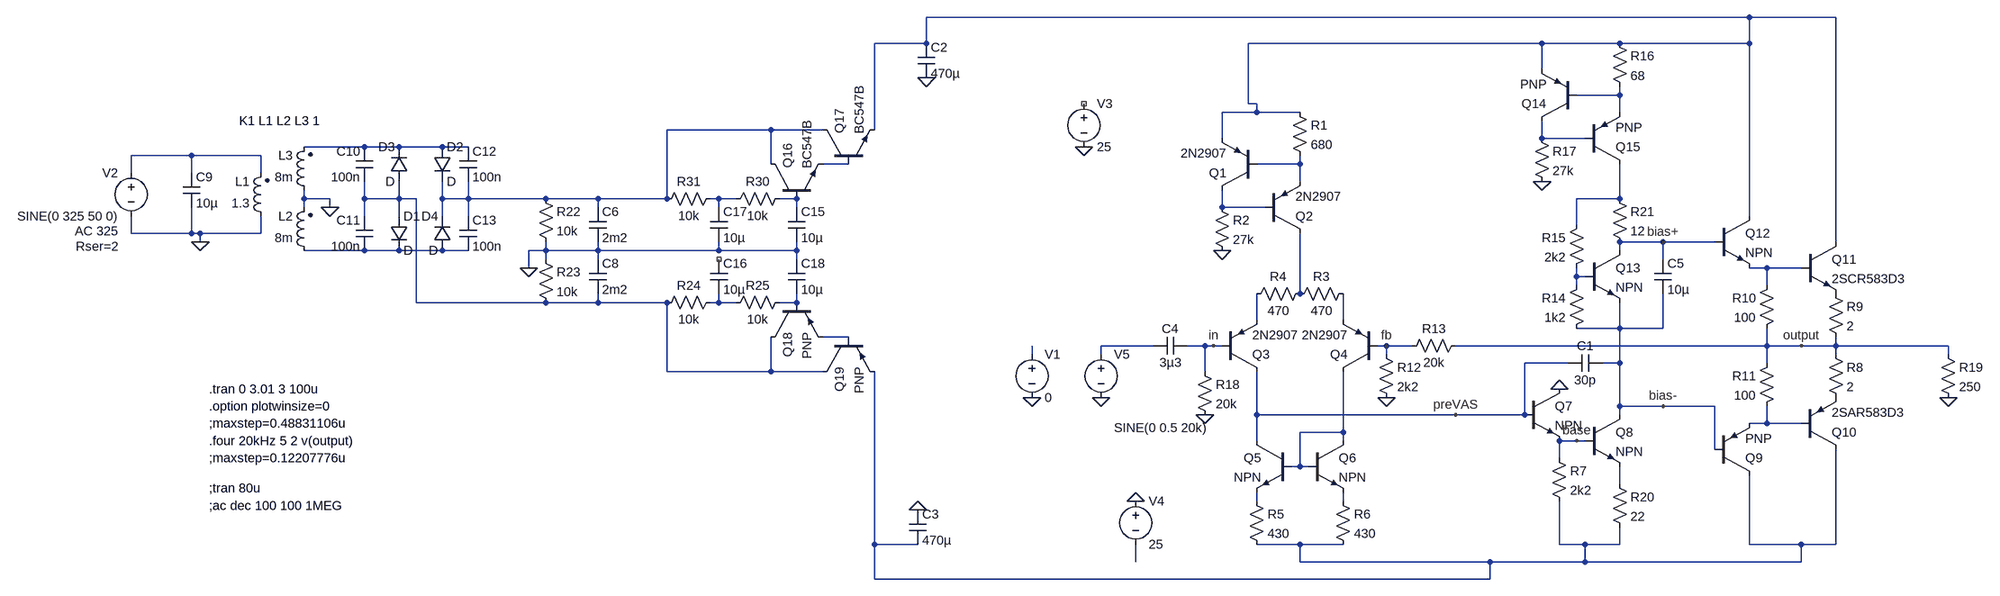
[diagram p0: schematic full_amplifier.asc]
full_amplifier.asc, the LTspice schematic file:
Version 4
SHEET 1 4476 896
WIRE 1008 -176 -592 -176
WIRE 1168 -176 1008 -176
WIRE -592 -128 -592 -176
WIRE -592 -128 -688 -128
WIRE 624 -128 80 -128
WIRE 768 -128 624 -128
WIRE 1008 -128 1008 -176
WIRE 1008 -128 768 -128
WIRE 624 -80 624 -128
WIRE 768 -32 768 -48
WIRE 768 -32 688 -32
WIRE 80 -16 80 -128
WIRE 96 -16 80 -16
WIRE 96 0 96 -16
WIRE 96 0 32 0
WIRE 176 0 96 0
WIRE 768 0 768 -32
WIRE -880 32 -1072 32
WIRE -784 32 -880 32
WIRE -688 32 -688 -128
WIRE 32 48 32 0
WIRE 624 48 624 16
WIRE 704 48 624 48
WIRE -1632 64 -1744 64
WIRE -1568 64 -1632 64
WIRE -1488 64 -1568 64
WIRE -1440 64 -1488 64
WIRE -1952 80 -2064 80
WIRE -1824 80 -1952 80
WIRE -880 96 -880 32
WIRE -736 96 -784 96
WIRE 176 96 176 80
WIRE 176 96 96 96
WIRE -2064 112 -2064 80
WIRE -1952 112 -1952 80
WIRE -1824 112 -1824 80
WIRE 176 128 176 96
WIRE -1744 160 -1744 144
WIRE -1696 160 -1744 160
WIRE -1632 160 -1632 128
WIRE -1568 160 -1568 128
WIRE -1568 160 -1632 160
WIRE -1536 160 -1568 160
WIRE -1488 160 -1488 128
WIRE -1440 160 -1440 128
WIRE -1440 160 -1488 160
WIRE -1296 160 -1440 160
WIRE -1200 160 -1296 160
WIRE -1072 160 -1072 32
WIRE -1072 160 -1200 160
WIRE -976 160 -992 160
WIRE -944 160 -976 160
WIRE -832 160 -864 160
WIRE 768 160 768 96
WIRE 768 160 688 160
WIRE -1744 176 -1744 160
WIRE -1696 176 -1696 160
WIRE -1200 176 -1200 160
WIRE -976 176 -976 160
WIRE -832 176 -832 160
WIRE 32 176 32 144
WIRE 112 176 32 176
WIRE -1632 192 -1632 160
WIRE -1568 192 -1568 160
WIRE -1488 192 -1488 160
WIRE -1440 192 -1440 160
WIRE 1008 192 1008 -128
WIRE 688 208 688 160
WIRE -2064 224 -2064 192
WIRE -1952 224 -1952 176
WIRE -1952 224 -2064 224
WIRE -1936 224 -1952 224
WIRE -1824 224 -1824 192
WIRE -1824 224 -1936 224
WIRE -1936 240 -1936 224
WIRE 848 240 768 240
WIRE 944 240 848 240
WIRE 1168 240 1168 -176
WIRE -1632 256 -1744 256
WIRE -1568 256 -1632 256
WIRE -1488 256 -1568 256
WIRE -1440 256 -1488 256
WIRE -1296 256 -1296 240
WIRE -1296 256 -1328 256
WIRE -1200 256 -1200 240
WIRE -1200 256 -1296 256
WIRE -976 256 -976 240
WIRE -976 256 -1200 256
WIRE -832 256 -832 240
WIRE -832 256 -976 256
WIRE 768 256 768 240
WIRE -1296 272 -1296 256
WIRE -1200 272 -1200 256
WIRE -832 272 -832 256
WIRE 848 272 848 240
WIRE -1328 288 -1328 256
WIRE 1040 288 1008 288
WIRE 1104 288 1040 288
WIRE 688 304 688 288
WIRE 704 304 688 304
WIRE 688 320 688 304
WIRE 1040 320 1040 288
WIRE 176 336 176 224
WIRE -1536 352 -1536 160
WIRE -1296 352 -1536 352
WIRE -1200 352 -1200 336
WIRE -1200 352 -1296 352
WIRE -1072 352 -1200 352
WIRE -976 352 -976 336
WIRE -976 352 -992 352
WIRE -944 352 -976 352
WIRE -832 352 -832 336
WIRE -832 352 -864 352
WIRE 96 384 96 336
WIRE 256 384 256 336
WIRE 768 400 768 352
WIRE 768 400 688 400
WIRE 848 400 848 336
WIRE 848 400 768 400
WIRE -736 416 -784 416
WIRE -96 432 -192 432
WIRE 0 432 -32 432
WIRE 16 432 0 432
WIRE 32 432 16 432
WIRE 336 432 320 432
WIRE 384 432 336 432
WIRE 1040 432 1040 400
WIRE 1040 432 464 432
WIRE 1104 432 1040 432
WIRE 1168 432 1168 416
WIRE 1168 432 1104 432
WIRE 1376 432 1168 432
WIRE -320 448 -320 432
WIRE -192 448 -192 432
WIRE 336 448 336 432
WIRE 1168 448 1168 432
WIRE 1376 448 1376 432
WIRE 672 464 592 464
WIRE 768 464 768 400
WIRE 768 464 736 464
WIRE 1040 464 1040 432
WIRE -1072 480 -1072 352
WIRE -880 480 -880 416
WIRE -880 480 -1072 480
WIRE -784 480 -880 480
WIRE 0 480 0 432
WIRE 768 544 768 464
WIRE 848 544 768 544
WIRE 944 544 848 544
WIRE 96 560 96 480
WIRE 464 560 96 560
WIRE 592 560 592 464
WIRE 592 560 464 560
WIRE 768 560 768 544
WIRE 1040 576 1040 544
WIRE 1040 576 1008 576
WIRE 1104 576 1040 576
WIRE 256 592 256 480
WIRE 256 592 176 592
WIRE 96 608 96 560
WIRE 256 608 256 592
WIRE 688 608 656 608
WIRE 704 608 688 608
WIRE 944 624 944 544
WIRE 656 640 656 608
WIRE 176 656 176 592
WIRE 176 656 160 656
WIRE 192 656 176 656
WIRE 768 688 768 656
WIRE 96 720 96 704
WIRE 256 720 256 704
WIRE -688 800 -688 480
WIRE -608 800 -688 800
WIRE 176 800 96 800
WIRE 256 800 176 800
WIRE 656 800 656 720
WIRE 704 800 656 800
WIRE 768 800 768 768
WIRE 768 800 704 800
WIRE 1008 800 1008 672
WIRE 1104 800 1008 800
WIRE 1168 800 1168 624
WIRE 1168 800 1104 800
WIRE -128 832 -128 800
WIRE 176 832 176 800
WIRE 528 832 176 832
WIRE 704 832 704 800
WIRE 704 832 528 832
WIRE 1104 832 1104 800
WIRE 1104 832 704 832
WIRE -688 864 -688 800
WIRE 528 864 528 832
WIRE 528 864 -688 864
FLAG 32 256 0
FLAG 656 512 0
FLAG 336 528 0
FLAG 624 128 0
FLAG 0 560 0
FLAG 1104 432 output
FLAG 848 240 bias+
FLAG 848 544 bias-
FLAG 464 560 preVAS
FLAG 336 432 fb
FLAG 1376 528 0
FLAG 688 608 base
FLAG 16 432 in
FLAG -192 528 0
FLAG -320 528 0
FLAG -1936 240 0
FLAG -1328 288 0
FLAG -1696 176 0
FLAG -592 -64 0
FLAG -224 64 0
FLAG -128 720 0
FLAG -608 736 0
SYMBOL pnp 96 144 R180
SYMATTR InstName Q1
SYMATTR Value 2N2907
SYMBOL pnp 112 224 M180
SYMATTR InstName Q2
SYMATTR Value 2N2907
SYMBOL res 160 -16 R0
SYMATTR InstName R1
SYMATTR Value 680
SYMBOL res 16 160 R0
SYMATTR InstName R2
SYMATTR Value 27k
SYMBOL res 272 320 R90
WINDOW 0 0 56 VBottom 2
WINDOW 3 32 56 VTop 2
SYMATTR InstName R3
SYMATTR Value 470
SYMBOL res 192 320 R90
WINDOW 0 0 56 VBottom 2
WINDOW 3 32 56 VTop 2
SYMATTR InstName R4
SYMATTR Value 470
SYMBOL pnp 32 480 M180
SYMATTR InstName Q3
SYMATTR Value 2N2907
SYMBOL pnp 320 480 R180
SYMATTR InstName Q4
SYMATTR Value 2N2907
SYMBOL npn 160 608 M0
SYMATTR InstName Q5
SYMBOL npn 192 608 R0
SYMATTR InstName Q6
SYMBOL res 80 704 R0
SYMATTR InstName R5
SYMATTR Value 430
SYMBOL res 240 704 R0
SYMATTR InstName R6
SYMATTR Value 430
SYMBOL npn 592 512 R0
SYMATTR InstName Q7
SYMBOL npn 704 560 R0
SYMATTR InstName Q8
SYMBOL res 640 624 R0
SYMATTR InstName R7
SYMATTR Value 2k2
SYMBOL cap 736 448 R90
WINDOW 0 0 32 VBottom 2
WINDOW 3 32 32 VTop 2
SYMATTR InstName C1
SYMATTR Value 30p
SYMBOL pnp 944 672 M180
SYMATTR InstName Q9
SYMBOL pnp 1104 624 M180
SYMATTR InstName Q10
SYMATTR Value 2SAR583D3
SYMBOL res 1152 432 R0
SYMATTR InstName R8
SYMATTR Value 2
SYMBOL res 1152 320 R0
SYMATTR InstName R9
SYMATTR Value 2
SYMBOL npn 1104 240 R0
SYMATTR InstName Q11
SYMATTR Value 2SCR583D3
SYMBOL npn 944 192 R0
SYMATTR InstName Q12
SYMBOL res 1056 304 M0
SYMATTR InstName R10
SYMATTR Value 100
SYMBOL res 1056 448 M0
SYMATTR InstName R11
SYMATTR Value 100
SYMBOL res 320 432 R0
SYMATTR InstName R12
SYMATTR Value 2k2
SYMBOL res 480 416 R90
WINDOW 0 0 56 VBottom 2
WINDOW 3 32 56 VTop 2
SYMATTR InstName R13
SYMATTR Value 20k
SYMBOL npn 704 256 R0
SYMATTR InstName Q13
SYMBOL res 704 304 M0
SYMATTR InstName R14
SYMATTR Value 1k2
SYMBOL res 704 192 M0
SYMATTR InstName R15
SYMATTR Value 2k2
SYMBOL pnp 688 16 R180
SYMATTR InstName Q14
SYMBOL pnp 704 96 M180
SYMATTR InstName Q15
SYMBOL res 752 -144 R0
SYMATTR InstName R16
SYMATTR Value 68
SYMBOL res 608 32 R0
SYMATTR InstName R17
SYMATTR Value 27k
SYMBOL res -16 464 R0
SYMATTR InstName R18
SYMATTR Value 20k
SYMBOL res 1360 432 R0
SYMATTR InstName R19
SYMATTR Value 250
SYMBOL res 752 672 R0
SYMATTR InstName R20
SYMATTR Value 22
SYMBOL voltage -192 432 R0
WINDOW 3 24 152 Left 2
WINDOW 123 24 124 Left 2
WINDOW 39 0 0 Left 0
SYMATTR Value SINE(0 0.5 20k)
SYMATTR InstName V5
SYMBOL cap -32 416 R90
WINDOW 0 0 32 VBottom 2
WINDOW 3 32 32 VTop 2
SYMATTR InstName C4
SYMATTR Value 3µ3
SYMBOL res 752 144 R0
SYMATTR InstName R21
SYMATTR Value 12
SYMBOL cap 832 272 R0
SYMATTR InstName C5
SYMATTR Value 10µ
SYMBOL voltage -320 432 R0
WINDOW 123 0 0 Left 0
WINDOW 39 0 0 Left 0
SYMATTR InstName V1
SYMATTR Value 0
SYMBOL ind2 -1808 208 R180
WINDOW 0 36 80 Left 2
WINDOW 3 36 40 Left 2
SYMATTR InstName L1
SYMATTR Value 1.3
SYMATTR Type ind
SYMATTR SpiceLine Rser=100
SYMBOL ind2 -1728 272 R180
WINDOW 0 36 80 Left 2
WINDOW 3 36 40 Left 2
SYMATTR InstName L2
SYMATTR Value 8m
SYMATTR Type ind
SYMATTR SpiceLine Rser=0.6
SYMBOL voltage -2064 96 M0
WINDOW 123 24 124 Left 2
WINDOW 39 24 152 Left 2
SYMATTR Value2 AC 325
SYMATTR SpiceLine Rser=2
SYMATTR InstName V2
SYMATTR Value SINE(0 325 50 0)
SYMBOL ind2 -1728 160 R180
WINDOW 0 36 80 Left 2
WINDOW 3 36 40 Left 2
SYMATTR InstName L3
SYMATTR Value 8m
SYMATTR Type ind
SYMATTR SpiceLine Rser=0.6
SYMBOL res -1312 144 R0
SYMATTR InstName R22
SYMATTR Value 10k
SYMBOL res -1312 256 R0
SYMATTR InstName R23
SYMATTR Value 10k
SYMBOL diode -1584 192 R0
SYMATTR InstName D1
SYMBOL diode -1504 64 R0
SYMATTR InstName D2
SYMBOL diode -1552 128 R180
WINDOW 0 24 64 Left 2
WINDOW 3 24 0 Left 2
SYMATTR InstName D3
SYMBOL diode -1472 256 R180
WINDOW 0 24 64 Left 2
WINDOW 3 24 0 Left 2
SYMATTR InstName D4
SYMBOL cap -1216 176 R0
SYMATTR InstName C6
SYMATTR Value 2m2
SYMATTR SpiceLine Rser=100m Lser=20n
SYMBOL cap -1968 112 R0
SYMATTR InstName C9
SYMATTR Value 10µ
SYMBOL cap -1616 64 M0
SYMATTR InstName C10
SYMATTR Value 100n
SYMBOL cap -1616 192 M0
SYMATTR InstName C11
SYMATTR Value 100n
SYMBOL cap -1456 64 R0
SYMATTR InstName C12
SYMATTR Value 100n
SYMBOL cap -1456 192 R0
SYMATTR InstName C13
SYMATTR Value 100n
SYMBOL res -848 144 R90
WINDOW 0 0 56 VBottom 2
WINDOW 3 32 56 VTop 2
SYMATTR InstName R30
SYMATTR Value 10k
SYMBOL cap -848 176 R0
SYMATTR InstName C15
SYMATTR Value 10µ
SYMBOL npn -880 160 R270
SYMATTR InstName Q16
SYMATTR Value BC547B
SYMBOL res -976 144 R90
WINDOW 0 0 56 VBottom 2
WINDOW 3 32 56 VTop 2
SYMATTR InstName R31
SYMATTR Value 10k
SYMBOL cap -992 176 R0
SYMATTR InstName C17
SYMATTR Value 10µ
SYMBOL npn -784 96 R270
SYMATTR InstName Q17
SYMATTR Value BC547B
SYMBOL cap -1216 272 R0
SYMATTR InstName C8
SYMATTR Value 2m2
SYMATTR SpiceLine Rser=100m Lser=20n
SYMBOL cap -992 272 R0
SYMATTR InstName C16
SYMATTR Value 10µ
SYMBOL cap -848 272 R0
SYMATTR InstName C18
SYMATTR Value 10µ
SYMBOL res -976 336 R90
WINDOW 0 0 56 VBottom 2
WINDOW 3 32 56 VTop 2
SYMATTR InstName R24
SYMATTR Value 10k
SYMBOL res -848 336 R90
WINDOW 0 0 56 VBottom 2
WINDOW 3 32 56 VTop 2
SYMATTR InstName R25
SYMATTR Value 10k
SYMBOL pnp -880 352 M90
SYMATTR InstName Q18
SYMBOL pnp -784 416 M90
SYMATTR InstName Q19
SYMBOL cap -608 -128 R0
SYMATTR InstName C2
SYMATTR Value 470µ
SYMATTR SpiceLine Rser=100m Lser=20n
SYMBOL cap -624 736 R0
SYMATTR InstName C3
SYMATTR Value 470µ
SYMATTR SpiceLine Rser=100m Lser=20n
SYMBOL voltage -224 -32 R0
WINDOW 123 0 0 Left 0
WINDOW 39 0 0 Left 0
SYMATTR InstName V3
SYMATTR Value 25
SYMBOL voltage -128 704 R0
WINDOW 123 0 0 Left 0
WINDOW 39 0 0 Left 0
SYMATTR InstName V4
SYMATTR Value 25
TEXT -1920 728 Left 2 !;ac dec 100 100 1MEG
TEXT -1920 696 Left 2 !;tran 80u
TEXT -1920 512 Left 2 !.tran 0 3.01 3 100u
TEXT -1920 544 Left 2 !.option plotwinsize=0
TEXT -1920 576 Left 2 !;maxstep=0.48831106u
TEXT -1920 608 Left 2 !.four 20kHz 5 2 v(output)
TEXT -1920 640 Left 2 !;maxstep=0.12207776u
TEXT -1864 16 Left 2 !K1 L1 L2 L3 1

The netlist it stands for:
* full_amplifier.asc
Q1 N013 N008 N001 0 2N2907
Q2 N017 N013 N008 0 2N2907
R1 N001 N008 680
R2 N013 0 27k
R3 N021 N017 470
R4 N017 N020 470
Q3 preVAS in N020 0 2N2907
Q4 N026 fb N021 0 2N2907
Q5 preVAS N026 N028 0 NPN
Q6 N026 N026 N029 0 NPN
R5 N028 N030 430
R6 N029 N030 430
Q7 0 preVAS base 0 NPN
Q8 bias- base N027 0 NPN
R7 base N030 2k2
C1 bias- preVAS 30p
Q9 N030 bias- N025 0 PNP
Q10 N030 N025 P001 0 2SAR583D3
R8 output P001 2
R9 P002 output 2
Q11 N001 N015 P002 0 2SCR583D3
Q12 N001 bias+ N015 0 NPN
R10 N015 output 100
R11 output N025 100
R12 fb 0 2k2
R13 output fb 20k
Q13 bias+ N016 bias- 0 NPN
R14 N016 bias- 1k2
R15 N012 N016 2k2
Q14 N004 N002 N001 0 PNP
Q15 N012 N004 N002 0 PNP
R16 N001 N002 68
R17 N004 0 27k
R18 in 0 20k
R19 output 0 250
R20 N027 N030 22
V5 N023 0 SINE(0 0.5 20k)
C4 in N023 3µ3
R21 N012 bias+ 12
C5 bias+ bias- 10µ
V1 N024 0 0
L1 0 N006 1.3 Rser=100
L2 N014 0 8m Rser=0.6
V2 N006 0 SINE(0 325 50 0) AC 325 Rser=2
L3 0 N005 8m Rser=0.6
R22 N003 0 10k
R23 0 N009 10k
D1 N009 N014 D
D2 N005 N003 D
D3 N009 N005 D
D4 N014 N003 D
C6 N003 0 2m2 Rser=100m Lser=20n
C9 N006 0 10µ
C10 N005 N009 100n
C11 N009 N014 100n
C12 N005 N003 100n
C13 N003 N014 100n
R30 N011 N010 10k
C15 N011 0 10µ
Q16 N003 N011 N007 0 BC547B
R31 N010 N003 10k
C17 N010 0 10µ
Q17 N003 N007 N001 0 BC547B
C8 0 N009 2m2 Rser=100m Lser=20n
C16 NC_01 N018 10µ
C18 0 N019 10µ
R24 N018 N009 10k
R25 N019 N018 10k
Q18 N009 N019 N022 0 PNP
Q19 N009 N022 N030 0 PNP
C2 N001 0 470µ Rser=100m Lser=20n
C3 0 N030 470µ Rser=100m Lser=20n
V3 NC_02 0 25
V4 0 N031 25
.model D D
.lib standard.dio
.model NPN NPN
.model PNP PNP
.lib standard.bjt
;ac dec 100 100 1MEG
;tran 80u
.tran 0 3.01 3 100u
.option plotwinsize=0
;maxstep=0.48831106u
.four 20kHz 5 2 v(output)
;maxstep=0.12207776u
K1 L1 L2 L3 1
.backanno
.end